# EasyEDA Pro project Summer Robot.eprj, board New MOSFET Unit
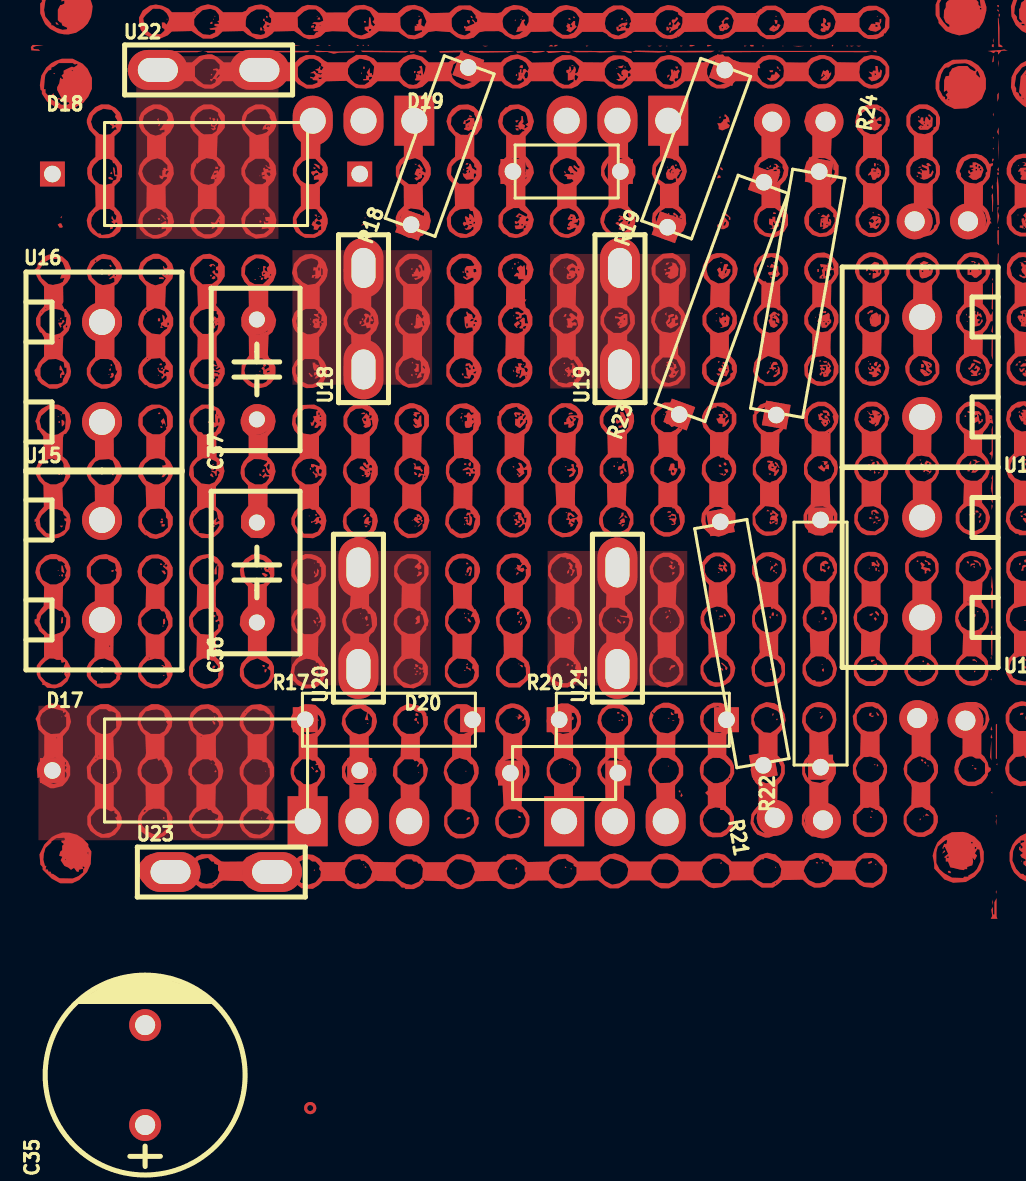
[diagram p14: board, top side]
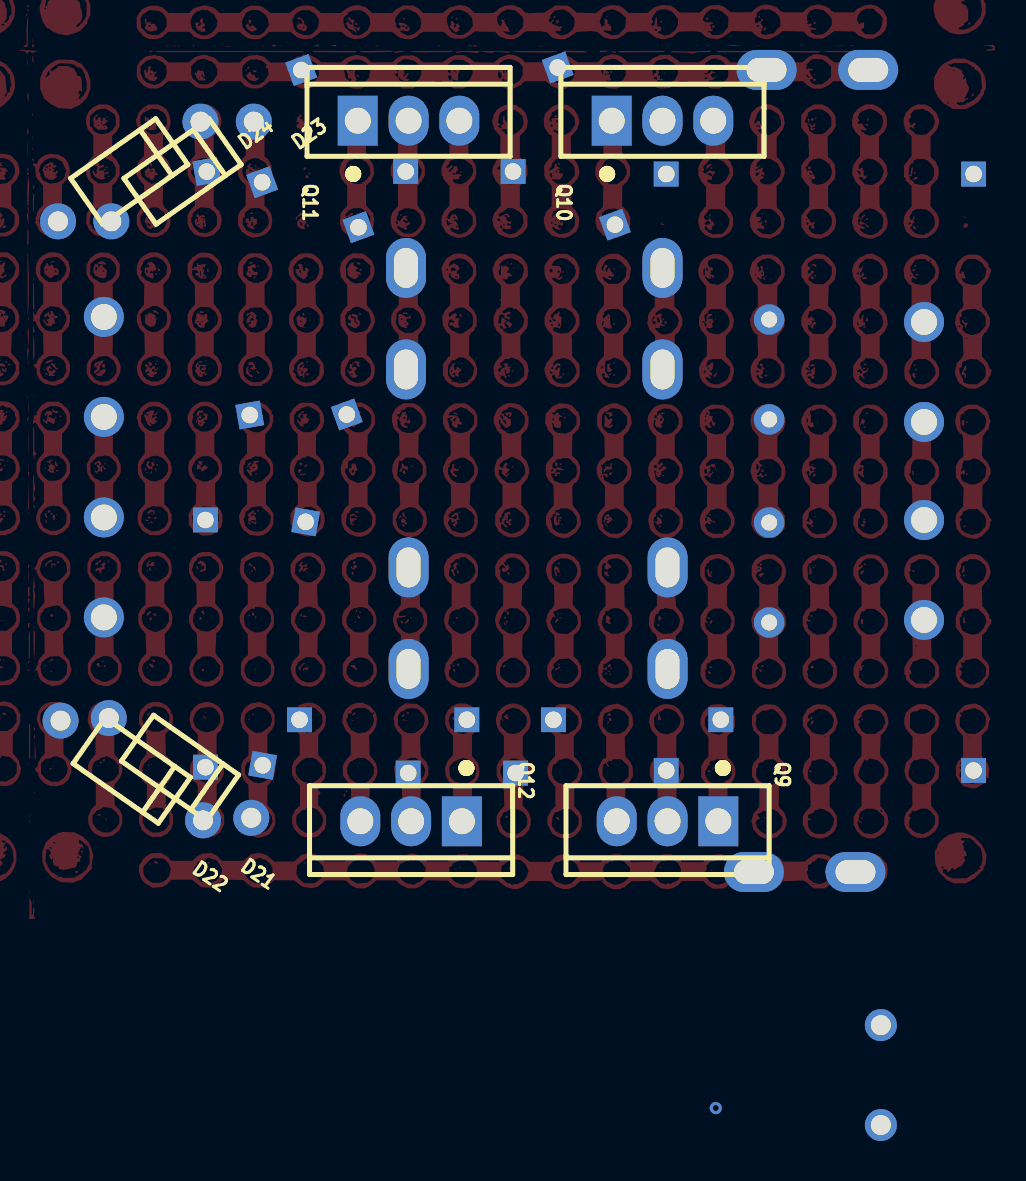
[diagram p15: board, bottom side, seen from below]

No outline. copper layers: Top Layer, Bottom Layer. Coordinates in mm from the lowest, leftmost part position.
Stack: Top Layer 0.035mm - / Dielectric1 1.51mm FR4 er 4.5 / Bottom Layer 0.035mm -

## Design rules (mm)
template: JLCPCB Capability(Two Layers Board)
spacing copperThickness1oz (default): track to track 0.102, other pairs 0.152 to 0.3
spacing copperThickness2oz: track to track 0.203, other pairs 0.152 to 0.3
track width copperThickness1oz (default): min 0.127, default 0.254, max 2.54
track width copperThickness2oz: min 0.203, default 0.254, max 2.54
differential pair differentialPair (default): width min 0.127, default 0.254, max 2.54; gap min 0.152, default 0.152
via viaSize (default): diameter min 0.5, default 0.61, max 10; hole min 0.3, default 0.305, max 6.3

## Placement (name value [footprint] x y rotation side)
C35  2200uF  [CAP-TH_BD10.0-P5.00-D0.6-FD]  2.16 0 90 top
C36  100nF  [CAP-TH_L8.0-W4.5-P5.00-D0.5]  7.75 25.15 90 top
C37  100nF  [CAP-TH_L8.0-W4.5-P5.00-D0.5]  7.75 35.31 90 top
D17  SR3100  [DO-201AD_BD5.3-L8.4-P12.50-D1.4-RD]  5.21 15.24 0 top
D18  SR3100  [DO-201AD_BD5.3-L8.4-P12.50-D1.4-RD]  5.21 45.08 0 top
D19  SR3100  [DO-201AD_BD5.3-L8.4-P12.50-D1.4-RD#2]  23.24 45.21 0 top
D20  SR3100  [DO-201AD_BD5.3-L8.4-P12.50-D1.4-RD#2]  23.11 15.11 0 top
D21  -  [DO-41_BD2.4-L4.7-P8.70-D0.9-RD]  37.21 15.37 35 bottom
D22  -  [DO-41_BD2.4-L4.7-P8.70-D0.9-RD]  39.62 15.24 35 bottom
D23  -  [DO-41_BD2.4-L4.7-P8.70-D0.9-RD]  37.08 45.21 325 bottom
D24  -  [DO-41_BD2.4-L4.7-P8.70-D0.9-RD]  39.75 45.21 325 bottom
Q9  IRLZ44NPBF  [TO-220-3_L10.0-W4.5-P2.54-T]  12.83 12.7 270 bottom
Q10  IRLZ44NPBF  [TO-220-3_L10.0-W4.5-P2.54-T]  13.08 47.75 90 bottom
Q11  IRLZ44NPBF  [TO-220-3_L10.0-W4.5-P2.54-T]  25.78 47.75 90 bottom
Q12  IRLZ44NPBF  [TO-220-3_L10.0-W4.5-P2.54-T]  25.65 12.7 270 bottom
R17  10kΩ  [RES-TH_BD2.4-L6.3-P10.30-D0.6]  14.35 17.78 0 top
R18  10kΩ  [RES-TH_BD2.4-L6.3-P10.30-D0.6]  16.89 46.48 70 top
R19  10kΩ  [RES-TH_BD2.4-L6.3-P10.30-D0.6]  29.72 46.35 70 top
R20  10kΩ  [RES-TH_BD2.4-L6.3-P10.30-D0.6]  27.05 17.78 0 top
R21  100Ω  [RES-TH_BD4.0-L11.5-P15.50-D0.7]  32 21.59 100 top
R22  100Ω  [RES-TH_BD4.0-L11.5-P15.50-D0.7]  35.94 21.59 90 top
R23  100Ω  [RES-TH_BD4.0-L11.5-P15.50-D0.7]  30.99 38.86 70 top
R24  100Ω  [RES-TH_BD4.0-L11.5-P15.50-D0.7]  34.8 39.12 260 top
U13  WJ126V-5.0-2P-16-00A  [CONN-TH_WJ126V-5.0-2P]  41.02 35.43 180 top
U14  WJ126V-5.0-2P-16-00A  [CONN-TH_WJ126V-5.0-2P]  41.02 25.4 180 top
U15  WJ126V-5.0-2P-16-00A  [CONN-TH_WJ126V-5.0-2P]  0 25.27 0 top
U16  WJ126V-5.0-2P-16-00A  [CONN-TH_WJ126V-5.0-2P]  0 35.18 0 top
U18  EST026  [CONN-TH_L6.3-W0.8-EST026]  13.08 37.85 90 top
U19  EST026  [CONN-TH_L6.3-W0.8-EST026]  25.91 37.85 90 top
U20  EST026  [CONN-TH_L6.3-W0.8-EST026]  12.83 22.86 90 top
U21  EST026  [CONN-TH_L6.3-W0.8-EST026]  25.78 22.86 90 top
U22  EST026  [CONN-TH_L6.3-W0.8-EST026]  5.33 50.29 0 top
U23  EST026  [CONN-TH_L6.3-W0.8-EST026]  5.97 10.16 0 top

## Footprints (pads in the part's own frame, mm; a bottom-side part is the same pattern mirrored in y, then rotated)
CAP-TH_BD10.0-P5.00-D0.6-FD
  round 1.6 hole 1: 1(-2.5,0) 2(2.5,0)
CAP-TH_L8.0-W4.5-P5.00-D0.5
  round 1.524 hole 0.8: 1(-2.5,0) 2(2.5,0)
CONN-TH_L6.3-W0.8-EST026
  oval 3x2 hole 2x1.2: 1(-2.54,0) 2(2.54,0)
CONN-TH_WJ126V-5.0-2P
  round 2 hole 1.3: 1(0,2.501) 2(0,-2.501)
DO-41_BD2.4-L4.7-P8.70-D0.9-RD
  round 1.8 hole 1: 1(-4.35,0) 2(4.35,0)
DO-201AD_BD5.3-L8.4-P12.50-D1.4-RD
  rect 1.245x1.245 hole 0.83: 1(-7.685,0) 2(7.685,0)
DO-201AD_BD5.3-L8.4-P12.50-D1.4-RD#2
  rect 1.245x1.245 hole 0.83: 1(-2.685,0) 2(2.685,0)
RES-TH_BD2.4-L6.3-P10.30-D0.6
  rect 1.245x1.245 hole 0.83: 1(-4.184,0) 2(4.184,0)
RES-TH_BD4.0-L11.5-P15.50-D0.7
  rect 1.245x1.245 hole 0.83: 1(-6.185,0) 2(6.185,0)
TO-220-3_L10.0-W4.5-P2.54-T
  rect 2.5x2 hole 1.3: 1(0,2.54)
  oval 2.5x2 hole 1.3: 2(0,0) 3(0,-2.54)

## Nets
As in the schematic, except:
$5N21952: C35.2 C36.1 D17.1 D18.1 D19.1 D20.1 U23.2
$5N21989: C35.1 C37.2 Q9.3 Q10.3 Q11.3 Q12.3 R17.2 R18.2 R19.2 R20.2 U22.2

Pads without a net: U18 2; U19 2; U20 2; U21 2; U22 1; U23 1

## Via types
v1: diameter 0.61, hole 0.305, Top Layer to Bottom Layer, 1 via

## Routing (per net, layer and track width the routed paths; a pad name or vN(x,y) marks a point on that pad's centre or on a via; arc(x,y) is an arc through that point)
(no net):
  vias: v1(10.41,-1.65)

## Copper pours and planes (outline as drawn; the poured copper is in the pictures)
(no net) on Top Layer: 9.52,41.27 16.51,41.27 16.51,34.54 9.52,34.54
(no net) on Top Layer: 22.42,41.08 29.4,41.08 29.4,34.35 22.42,34.35
(no net) on Top Layer: 9.46,26.23 16.45,26.23 16.45,19.49 9.46,19.49
(no net) on Top Layer: 22.29,26.23 29.27,26.23 29.27,19.49 22.29,19.49
$5N21952 on Top Layer: -3.18,18.48 8.64,18.48 8.64,11.75 -3.18,11.75
$5N21989 on Top Layer: 1.71,50.98 8.83,50.98 8.83,41.84 1.71,41.84

Small or netless copper shapes (teardrops, artwork), in the pictures only: 3198 on Top Layer
